# EAGLE design v1 (EAGLE 7.2.0)
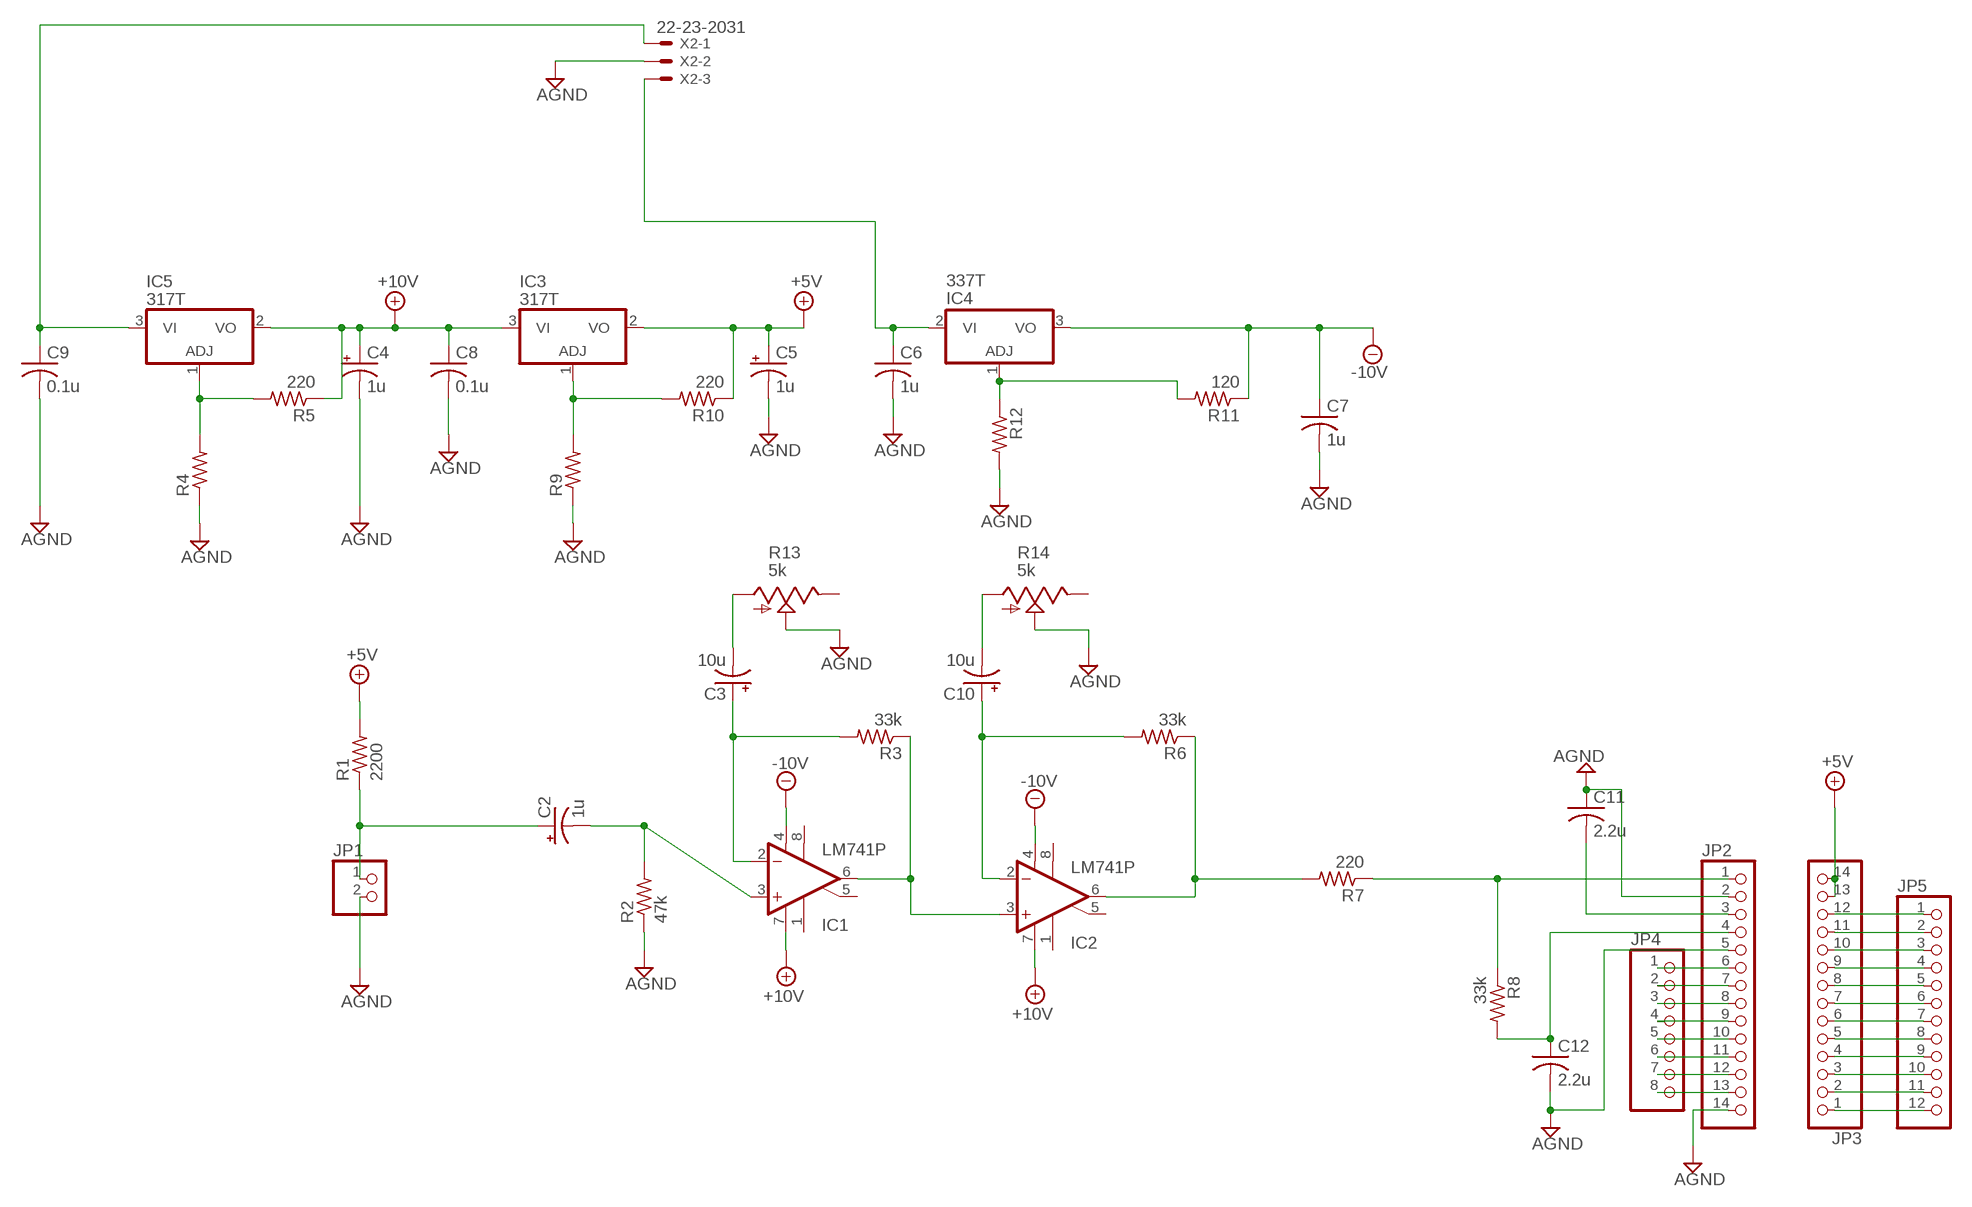
[diagram p0: schematic, sheet 1]

## Parts
C2  1u  CPOL-USE2.5-5  [E2,5-5]
C3  10u  CPOL-USE2.5-5  [E2,5-5]
C4  1u  CPOL-USE2.5-5  [E2,5-5]
C5  1u  CPOL-USE2.5-5  [E2,5-5]
C6  1u  C-US050-045X075  [C050-045X075]
C7  1u  C-US050-045X075  [C050-045X075]
C8  0.1u  C-US050-045X075  [C050-045X075]
C9  0.1u  C-US050-045X075  [C050-045X075]
C10  10u  CPOL-USE2.5-5  [E2,5-5]
C11  2.2u  C-US050-045X075  [C050-045X075]
C12  2.2u  C-US050-045X075  [C050-045X075]
IC1  LM741P  [DIL08]
IC2  LM741P  [DIL08]
IC3  317T  [TO220H]
IC4  337T  [TO220H]
IC5  317T  [TO220H]
JP1  PINHD-1X2  [1X02]
JP2  PINHD-1X14  [1X14]
JP3  PINHD-1X14  [1X14]
JP4  PINHD-1X8  [1X08]
JP5  PINHD-1X12  [1X12]
R1  2200  R-US_0207/10  [0207/10]
R2  47k  R-US_0207/10  [0207/10]
R3  33k  R-US_0207/10  [0207/10]
R4  R-US_0207/10  [0207/10]
R5  220  R-US_0207/10  [0207/10]
R6  33k  R-US_0207/10  [0207/10]
R7  220  R-US_0207/10  [0207/10]
R8  33k  R-US_0207/10  [0207/10]
R9  R-US_0207/10  [0207/10]
R10  220  R-US_0207/10  [0207/10]
R11  120  R-US_0207/10  [0207/10]
R12  R-US_0207/10  [0207/10]
R13  5k  TRIM_US-CA6V  [CA6V]
R14  5k  TRIM_US-CA6V  [CA6V]
X2  22-23-2031  [22-23-2031]

## Nets
+5V: C5.+ IC3.2(VO) JP3.13 JP3.14 R1.2 R10.1
+10V: C4.+ C8.1 IC1.7(V+) IC2.7(V+) IC3.3(VI) IC5.2(VO) R5.1
-10V: C7.1 IC1.4(V-) IC2.4(V-) IC4.3(VO) R11.1
AGND: C4.- C5.- C6.2 C7.2 C8.2 C9.2 C11.1 C12.2 JP1.2 JP2.2 JP2.5 JP2.14 R2.1 R4.1 R9.1 R12.2 R13.S R14.S X2.2
N$1: IC1.6(OUT) IC2.3(+IN) R3.1
N$2: C2.+ JP1.1 R1.1
N$3: C2.- IC1.3(+IN) R2.2
N$4: C3.+ IC1.2(-IN) R3.2
N$5: IC2.6(OUT) R6.1 R7.2
N$6: C10.+ IC2.2(-IN) R6.2
N$7: JP2.1 R7.1 R8.1
N$8: IC5.1(ADJ) R4.2 R5.2
N$9: IC3.1(ADJ) R9.2 R10.2
N$10: IC4.1(ADJ) R11.2 R12.1
N$11: C3.- R13.A
N$12: C6.1 IC4.2(VI) X2.3
N$13: C9.1 IC5.3(VI) X2.1
N$14: C10.- R14.A
N$15: C11.2 JP2.3
N$16: C12.1 JP2.4 R8.2
N$18: JP2.13 JP4.8
N$19: JP2.12 JP4.7
N$20: JP2.11 JP4.6
N$21: JP2.10 JP4.5
N$22: JP2.9 JP4.4
N$23: JP2.8 JP4.3
N$24: JP2.7 JP4.2
N$25: JP2.6 JP4.1
N$26: JP3.1 JP5.12
N$27: JP3.2 JP5.11
N$28: JP3.3 JP5.10
N$29: JP3.4 JP5.9
N$30: JP3.5 JP5.8
N$31: JP3.6 JP5.7
N$32: JP3.7 JP5.6
N$33: JP3.8 JP5.5
N$34: JP3.9 JP5.4
N$35: JP3.10 JP5.3
N$36: JP3.11 JP5.2
N$37: JP3.12 JP5.1
Unconnected: IC1.1(ON1) IC1.5(ON2) IC1.8(OPT) IC2.1(ON1) IC2.5(ON2) IC2.8(OPT) R13.E R14.E

## Library data of the parts
C2-C5 C10 = rcl:CPOL-US: POLARIZED CAPACITOR, American symbol
C6-C9 C11 C12 = rcl:C-US: CAPACITOR, American symbol
IC1 IC2 = linear:*741: OP AMP
IC3 IC5 = linear:*317: Positive VOLTAGE REGULATOR
IC4 = linear:*337: Negative VOLTAGE REGULATOR
JP1 = pinhead:PINHD-1X2: PIN HEADER
JP2 JP3 = pinhead:PINHD-1X14: PIN HEADER
JP4 = pinhead:PINHD-1X8: PIN HEADER
JP5 = pinhead:PINHD-1X12: PIN HEADER
R1-R12 = resistor:R-US_: RESISTOR, American symbol
R13 R14 = pot:TRIM_US-: POTENTIOMETER
X2 = con-molex:22-23-2031: .100" (2.54mm) Center Header - 3 Pin; MF: MOLEX; MPN: 22-23-2031; OC_FARNELL: 1462950; OC_NEWARK: 30C0862

## Board
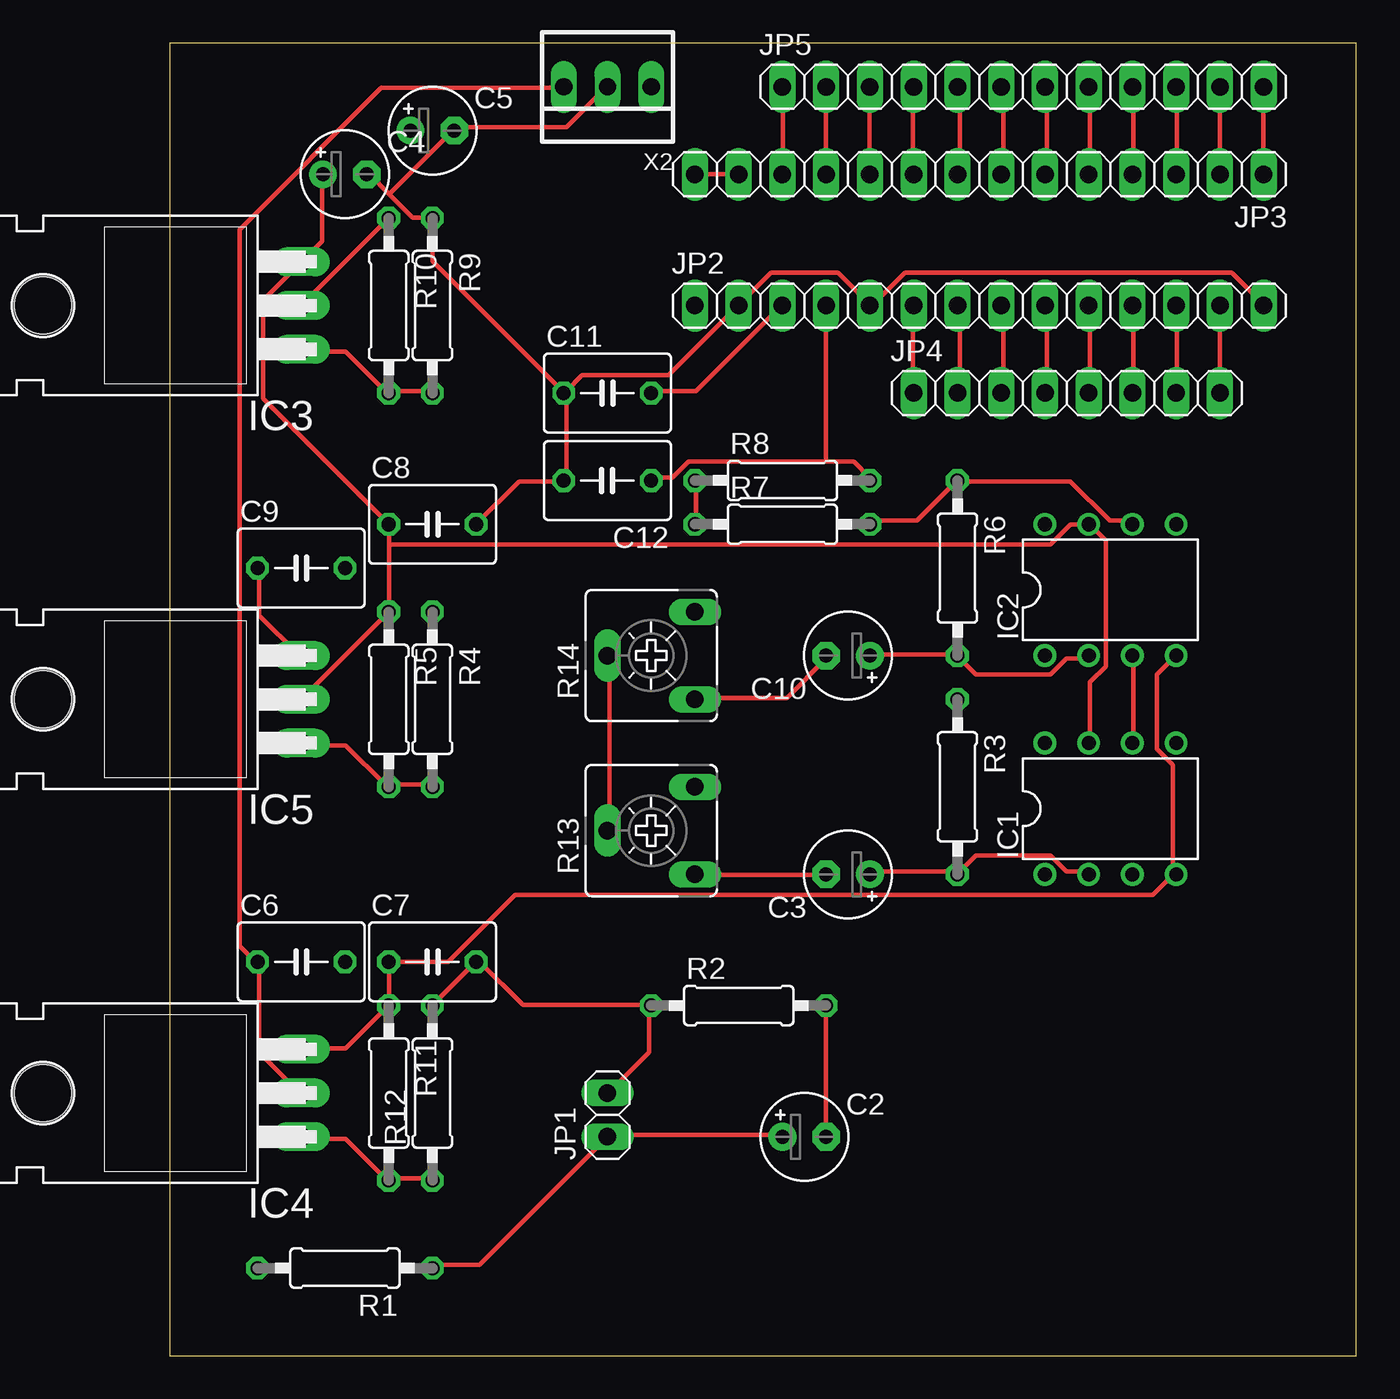
[diagram p1: board, top side]
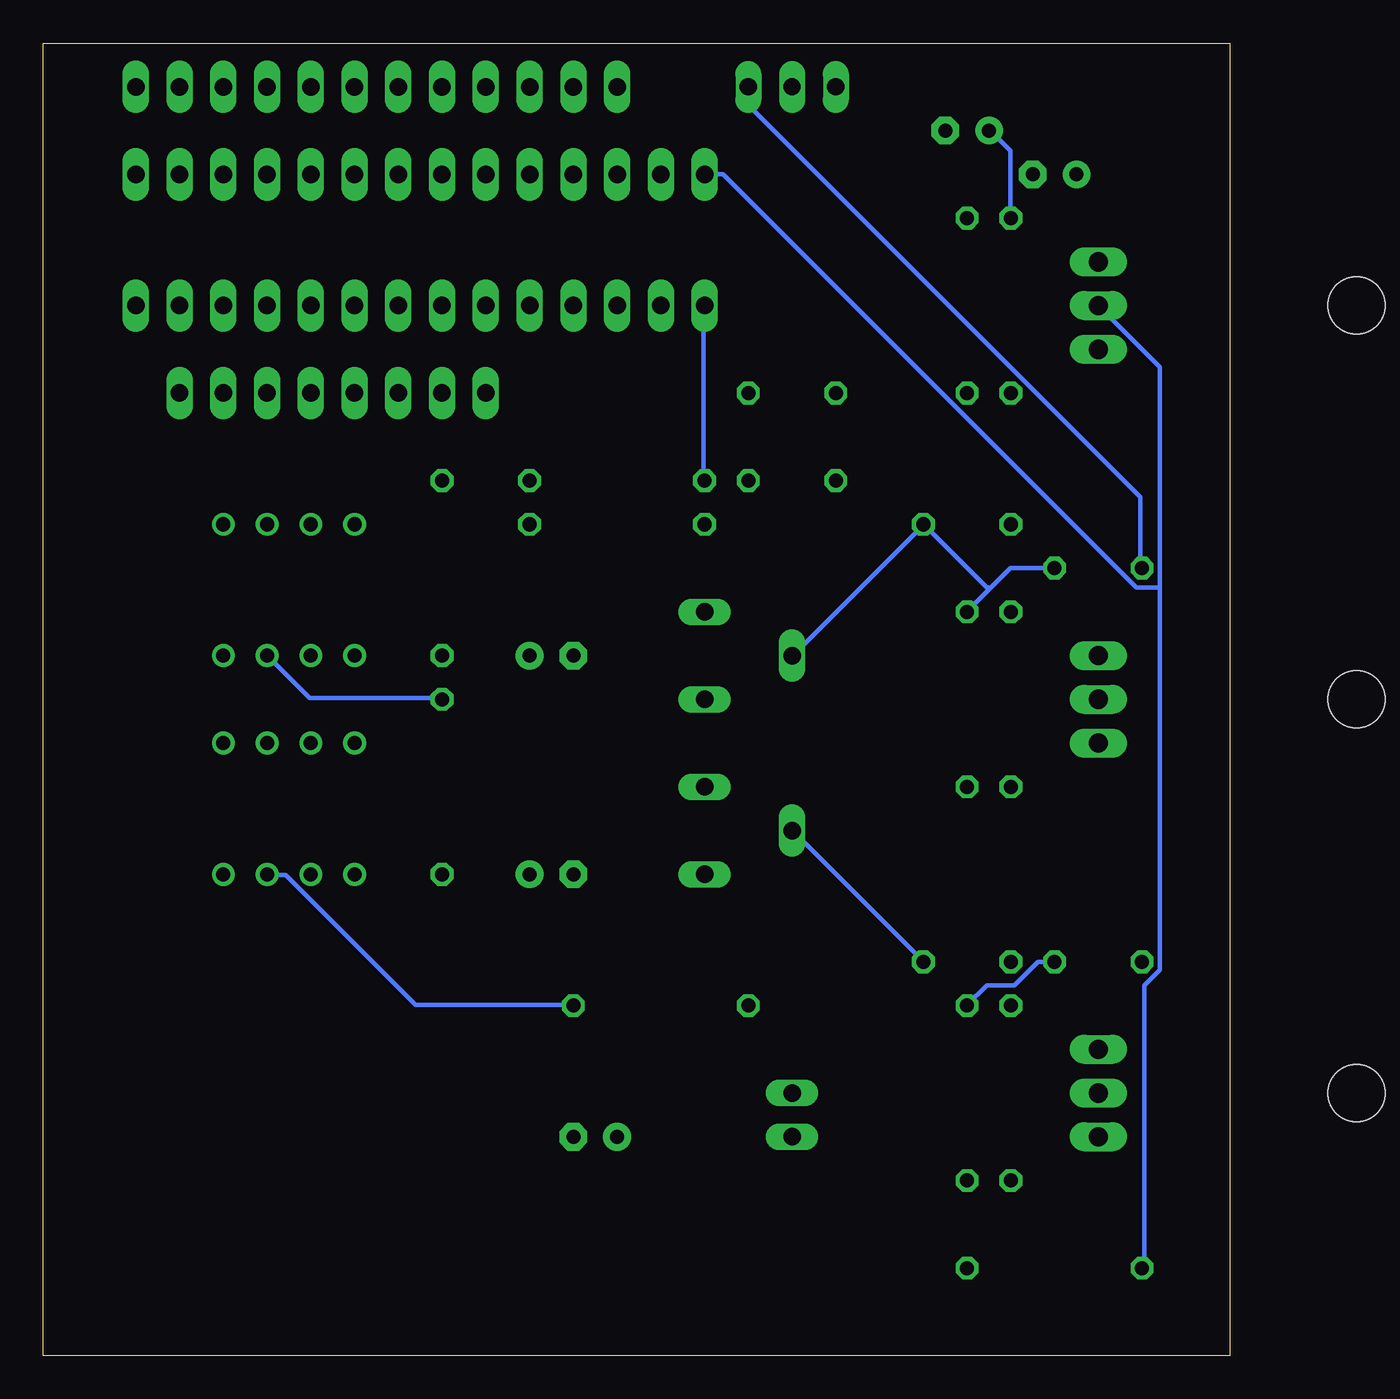
[diagram p2: board, bottom side, seen from below]

Size 68.88 x 76.2 mm. Coordinates in mm from the lower left corner, seen from the top.
Outline: 0,0 68.88,0 68.88,76.19 0,76.2 0,0
Copper layers (1*16): Top 0.035mm / dielectric 1.5mm / Bottom 0.035mm
Design rules "default": minimum track width 10mil, minimum drill 24mil, track to track 8mil, track to pad 8mil, pad to pad 8mil, via to via 8mil, smd to smd 8mil, copper to edge 40mil, drill to drill 8mil, minimum pad ring 10mil, minimum via ring 8mil, stop-mask expansion 4mil, vias tented up to drill 0mil, thermal gap 10mil

### Footprints (pad centres in the part's own frame; a part is rotated, then mirrored left to right if it is on the bottom)
E2,5-5 = drill 0.813 pad 1.6: + -1.27,0 | drill 0.813 pad 1.6 octagon: - 1.27,0
C050-045X075 = drill 0.813 octagon: 1 -2.54,0; 2 2.54,0
DIL08 = drill 0.813 pad 1.27: 1 -3.81,-3.81; 2 -1.27,-3.81; 3 1.27,-3.81; 4 3.81,-3.81; 5 3.81,3.81; 6 1.27,3.81; 7 -1.27,3.81; 8 -3.81,3.81
TO220H = drill 1.118 long: 1 -2.54,-10.16; 2 0,-10.16; 3 2.54,-10.16 | hole 3.302: 0,4.826
1X02 = drill 1.016 long: 1 -1.27,0; 2 1.27,0
1X14 = drill 1.016 long: 1 -16.51,0; 2 -13.97,0; 3 -11.43,0; 4 -8.89,0; 5 -6.35,0; 6 -3.81,0; 7 -1.27,0; 8 1.27,0; 9 3.81,0; 10 6.35,0; 11 8.89,0; 12 11.43,0; 13 13.97,0; 14 16.51,0
1X08 = drill 1.016 long: 1 -8.89,0; 2 -6.35,0; 3 -3.81,0; 4 -1.27,0; 5 1.27,0; 6 3.81,0; 7 6.35,0; 8 8.89,0
1X12 = drill 1.016 long: 1 -13.97,0; 2 -11.43,0; 3 -8.89,0; 4 -6.35,0; 5 -3.81,0; 6 -1.27,0; 7 1.27,0; 8 3.81,0; 9 6.35,0; 10 8.89,0; 11 11.43,0; 12 13.97,0
0207/10 = drill 0.813 octagon: 1 -5.08,0; 2 5.08,0
CA6V = drill 1.016 long: A -2.54,-2.54; E 2.54,-2.54; S 0,2.54
22-23-2031 = drill 1 long: 1 -2.54,0; 2 0,0; 3 2.54,0

### Placement (x,y rotation side)
C2  36.83,12.7 0 top
C3  39.37,27.94 180 top
C4  10.16,68.58 0 top
C5  15.24,71.12 0 top
C6  7.62,22.86 0 top
C7  15.24,22.86 0 top
C8  15.24,48.26 0 top
C9  7.62,45.72 0 top
C10  39.37,40.64 180 top
C11  25.4,55.88 0 top
C12  25.4,50.8 180 top
IC1  54.61,31.75 0 top
IC2  54.61,44.45 0 top
IC3  -2.54,60.96 90 top
IC4  -2.54,15.24 90 top
IC5  -2.54,38.1 90 top
JP1  25.4,13.97 90 top
JP2  46.99,60.96 0 top
JP3  46.99,68.58 180 top
JP4  52.07,55.88 0 top
JP5  49.53,73.66 0 top
R1  10.16,5.08 180 top
R2  33.02,20.32 0 top
R3  45.72,33.02 270 top
R4  15.24,38.1 270 top
R5  12.7,38.1 270 top
R6  45.72,45.72 270 top
R7  35.56,48.26 0 top
R8  35.56,50.8 0 top
R9  15.24,60.96 270 top
R10  12.7,60.96 270 top
R11  12.7,15.24 270 top
R12  15.24,15.24 90 top
R13  27.94,30.48 90 top
R14  27.94,40.64 90 top
X2  25.4,73.66 180 top

### Tracks (layer width: path | path; a pad name or v marks a point on that pad's centre or on a via)
+5V
  Top 0.254: JP3.13 JP3.14 | IC3.2 R10.1
  Bottom 0.254: R10.1 12.72,66.06 12.72,69.95 13.87,71.09 C5.+ | 4.04,44.58 4.04,57.38 IC3.2 | 4.04,44.58 4.04,22.4 4.95,21.49 4.95,5.26 R1.2 | JP3.14 29.41,68.58 5.41,44.58 4.04,44.58
+10V
  Top 0.254: IC1.7 53.42,35.66 53.42,39.09 54.33,40.01 54.33,47.32 53.42,48.23 IC2.7 53.19,48.23 52.27,48.23 51.13,47.09 12.72,47.09 | C4.+ 8.84,68.58 8.84,64.69 7.7,63.55 IC3.3 7.47,63.32 5.41,61.27 5.41,55.55 C8.1 12.72,48.23 12.72,47.09 | 12.72,47.09 12.72,43.2 R5.1 IC5.2
-10V
  Top 0.254: 12.72,22.86 12.72,20.34 R11.1 10.21,17.83 7.7,17.83 IC4.3 | IC2.4 58.22,40.46 57.3,39.55 57.3,35.2 58.22,34.29 58.22,28.12 IC1.4 58.22,27.89 57.07,26.75 20.04,26.75 16.15,22.86 12.72,22.86 | 12.72,22.86 C7.1
AGND
  Top 0.254: R13.S 25.53,30.63 25.53,40.46 R14.S | JP1.2 25.53,15.32 27.81,17.6 27.81,20.12 R2.1 27.81,20.34 20.5,20.34 17.98,22.86 C7.2 17.75,22.86 15.24,20.34 R12.2 | JP2.14 63.47,61.04 61.65,62.87 42.67,62.87 40.84,61.04 JP2.5 40.61,61.04 38.79,62.87 34.9,62.87 33.07,61.04 JP2.2 32.84,60.81 28.96,56.92 23.93,56.92 23.01,56.01 C11.1 | 12.72,67.44 11.58,68.58 C4.- | 12.72,67.44 14.1,66.06 15.24,66.06 R9.1 15.24,63.55 22.78,56.01 C11.1 | X2.2 25.3,73.61 23.01,71.32 16.61,71.32 C5.- 16.38,71.09 12.72,67.44 | C11.1 23.01,55.78 23.01,50.98 C12.2 22.78,50.75 20.27,50.75 C8.2
  Bottom 0.254: C6.2 11.12,22.86 12.5,21.49 14.1,21.49 15.24,20.34 R12.2 | R13.S 25.3,30.4 17.75,22.86 C7.2 | C9.2 12.72,45.72 13.87,44.58 | 13.87,44.58 15.24,43.2 R4.1 | 17.75,48.23 14.1,44.58 13.87,44.58 | 17.75,48.23 25.3,40.69 R14.S | 17.75,48.23 C8.2
N$1
  Top 0.254: IC1.6 55.93,35.66 55.93,40.46 IC2.3
  Bottom 0.254: IC2.3 53.42,38.18 45.87,38.18 R3.1
N$2
  Top 0.254: R1.1 15.24,5.26 17.98,5.26 25.3,12.57 JP1.1 25.53,12.8 35.36,12.8 C2.+
N$3
  Top 0.254: C2.- R2.2
  Bottom 0.254: IC1.3 55.7,27.89 54.79,27.89 47.24,20.34 38.1,20.34 R2.2
N$4
  Top 0.254: C3.+ 40.84,28.12 45.64,28.12 R3.2 45.87,28.12 46.79,29.03 51.13,29.03 52.05,28.12 53.19,28.12 IC1.2
N$5
  Top 0.254: R7.2 40.84,48.46 43.36,48.46 45.64,50.75 R6.1 45.87,50.75 52.27,50.75 54.56,48.46 55.7,48.46 IC2.6
N$6
  Top 0.254: C10.+ 40.84,40.69 45.64,40.69 R6.2 45.87,40.46 46.79,39.55 51.13,39.55 52.05,40.46 53.19,40.46 IC2.2
N$7
  Top 0.254: R7.1 30.56,48.46 30.56,50.75 R8.1
  Bottom 0.254: JP2.1 30.56,60.81 30.56,50.98 R8.1
N$8
  Top 0.254: R4.2 15.24,33.15 12.72,33.15 R5.2 12.5,33.15 10.21,35.43 7.7,35.43 IC5.1
N$9
  Top 0.254: R9.2 15.24,56.01 12.72,56.01 R10.2 12.5,56.01 10.21,58.29 7.7,58.29 IC3.1
N$10
  Top 0.254: R12.1 15.24,10.29 12.72,10.29 R11.2 12.5,10.29 10.21,12.57 7.7,12.57 IC4.1
N$11
  Top 0.254: R13.A 30.56,27.89 38.1,27.89 C3.-
N$12
  Top 0.254: IC4.2 7.47,15.32 5.18,17.6 5.18,22.86 C6.1 4.95,22.86 4.04,23.77 4.04,65.38 12.27,73.61 22.78,73.61 X2.3
N$13
  Top 0.254: C9.1 5.18,45.72 5.18,42.98 7.47,40.69 IC5.3
  Bottom 0.254: X2.1 27.81,73.61 27.81,72.47 5.18,49.84 5.18,45.72 C9.1
N$14
  Top 0.254: R14.A 30.56,38.18 35.81,38.18 38.1,40.46 C10.-
N$15
  Top 0.254: C11.2 28.04,56.01 30.56,56.01 35.36,60.81 JP2.3
N$16
  Top 0.254: 38.1,51.89 39.7,51.89 40.61,50.98 R8.2 | 38.1,51.89 30.1,51.89 29.18,50.98 28.04,50.98 C12.1 | 38.1,51.89 JP2.4
N$18
  Top 0.254: JP2.13 JP4.8
N$19
  Top 0.254: JP4.7 58.44,56.01 58.44,60.81 JP2.12
N$20
  Top 0.254: JP4.6 55.93,56.01 55.93,60.81 JP2.11
N$21
  Top 0.254: JP4.5 53.42,56.01 53.42,60.81 JP2.10
N$22
  Top 0.254: JP4.4 50.9,56.01 50.9,60.81 JP2.9
N$23
  Top 0.254: JP4.3 48.39,56.01 48.39,60.81 JP2.8
N$24
  Top 0.254: JP4.2 45.87,56.01 45.87,60.81 JP2.7
N$25
  Top 0.254: JP4.1 43.13,56.01 43.13,60.81 JP2.6
N$26
  Top 0.254: JP3.1 63.47,68.58 63.47,73.61 JP5.12
N$27
  Top 0.254: JP5.11 JP3.2
N$28
  Top 0.254: JP3.3 58.44,68.58 58.44,73.61 JP5.10
N$29
  Top 0.254: JP3.4 55.93,68.58 55.93,73.61 JP5.9
N$30
  Top 0.254: JP3.5 53.42,68.58 53.42,73.61 JP5.8
N$31
  Top 0.254: JP3.6 50.9,68.58 50.9,73.61 JP5.7
N$32
  Top 0.254: JP3.7 48.39,68.58 48.39,73.61 JP5.6
N$33
  Top 0.254: JP3.8 45.87,68.58 45.87,73.61 JP5.5
N$34
  Top 0.254: JP3.9 43.13,68.58 43.13,73.61 JP5.4
N$35
  Top 0.254: JP3.10 40.61,68.58 40.61,73.61 JP5.3
N$36
  Top 0.254: JP5.2 JP3.11
N$37
  Top 0.254: JP3.12 35.58,68.58 35.58,73.61 JP5.1